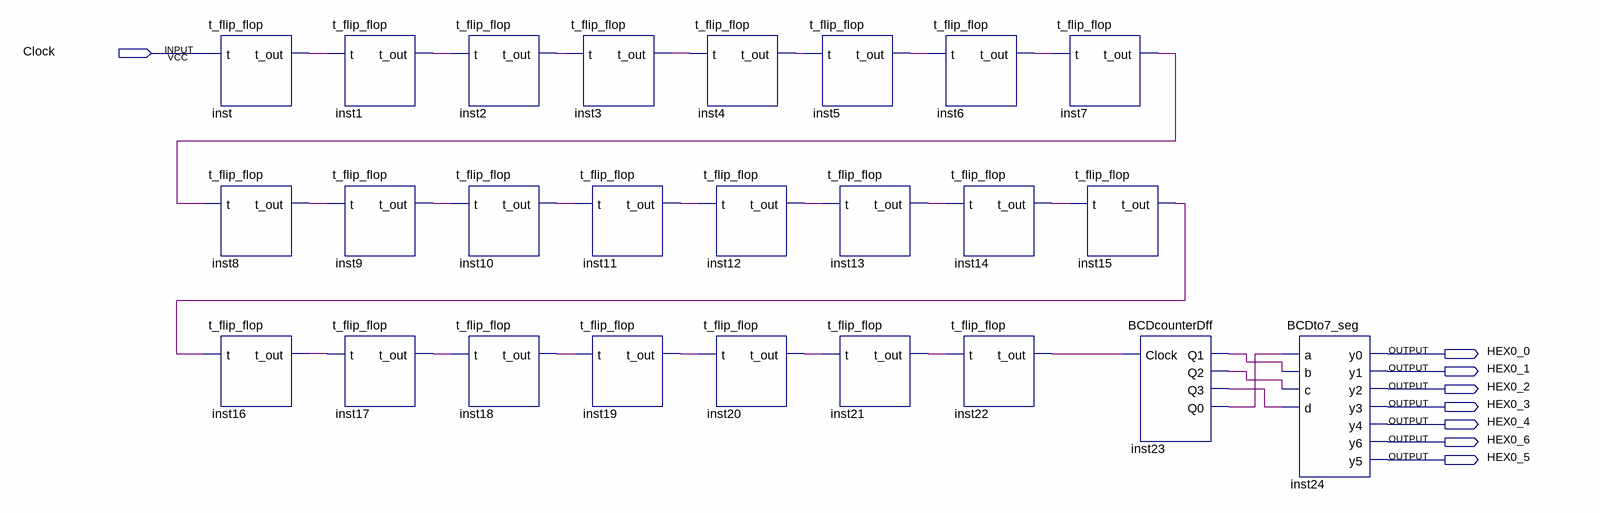
[diagram p0: schematic sheet]
// Quartus schematic BCDon7seg.bdf as structural Verilog: 25 symbols, 8 pins
module BCDon7seg (
  input  Clock,
  output HEX0_0,
  output HEX0_1,
  output HEX0_2,
  output HEX0_3,
  output HEX0_4,
  output HEX0_6,
  output HEX0_5
);

  wire inst1_t_out, inst2_t_out, inst3_t_out, inst4_t_out, inst5_t_out, inst6_t_out, inst7_t_out,
       inst8_t_out, inst9_t_out, inst10_t_out, inst11_t_out, inst12_t_out, inst13_t_out, inst14_t_out,
       inst15_t_out, inst16_t_out, inst17_t_out, inst18_t_out, inst19_t_out, inst20_t_out, inst21_t_out,
       inst22_t_out, inst23_q0, inst23_q1, inst23_q2, inst23_q3, inst_t_out;

  t_flip_flop inst (.t(Clock), .t_out(inst_t_out));
  t_flip_flop inst8 (.t(inst7_t_out), .t_out(inst8_t_out));
  t_flip_flop inst16 (.t(inst15_t_out), .t_out(inst16_t_out));
  t_flip_flop inst1 (.t(inst_t_out), .t_out(inst1_t_out));
  t_flip_flop inst9 (.t(inst8_t_out), .t_out(inst9_t_out));
  t_flip_flop inst17 (.t(inst16_t_out), .t_out(inst17_t_out));
  t_flip_flop inst2 (.t(inst1_t_out), .t_out(inst2_t_out));
  t_flip_flop inst10 (.t(inst9_t_out), .t_out(inst10_t_out));
  t_flip_flop inst18 (.t(inst17_t_out), .t_out(inst18_t_out));
  t_flip_flop inst3 (.t(inst2_t_out), .t_out(inst3_t_out));
  t_flip_flop inst11 (.t(inst10_t_out), .t_out(inst11_t_out));
  t_flip_flop inst19 (.t(inst18_t_out), .t_out(inst19_t_out));
  t_flip_flop inst4 (.t(inst3_t_out), .t_out(inst4_t_out));
  t_flip_flop inst12 (.t(inst11_t_out), .t_out(inst12_t_out));
  t_flip_flop inst20 (.t(inst19_t_out), .t_out(inst20_t_out));
  t_flip_flop inst5 (.t(inst4_t_out), .t_out(inst5_t_out));
  t_flip_flop inst13 (.t(inst12_t_out), .t_out(inst13_t_out));
  t_flip_flop inst21 (.t(inst20_t_out), .t_out(inst21_t_out));
  t_flip_flop inst6 (.t(inst5_t_out), .t_out(inst6_t_out));
  t_flip_flop inst14 (.t(inst13_t_out), .t_out(inst14_t_out));
  t_flip_flop inst22 (.t(inst21_t_out), .t_out(inst22_t_out));
  t_flip_flop inst7 (.t(inst6_t_out), .t_out(inst7_t_out));
  t_flip_flop inst15 (.t(inst14_t_out), .t_out(inst15_t_out));
  BCDcounterDff inst23 (.Clock(inst22_t_out), .Q1(inst23_q1), .Q2(inst23_q2), .Q3(inst23_q3), .Q0(inst23_q0));
  BCDto7_seg inst24 (
    .a(inst23_q0), .b(inst23_q1), .c(inst23_q2), .d(inst23_q3), .y0(HEX0_0), .y1(HEX0_1), .y2(HEX0_2),
    .y3(HEX0_3), .y4(HEX0_4), .y6(HEX0_6), .y5(HEX0_5));
endmodule
